# EAGLE design doppler_shield (EAGLE 7.2.0)
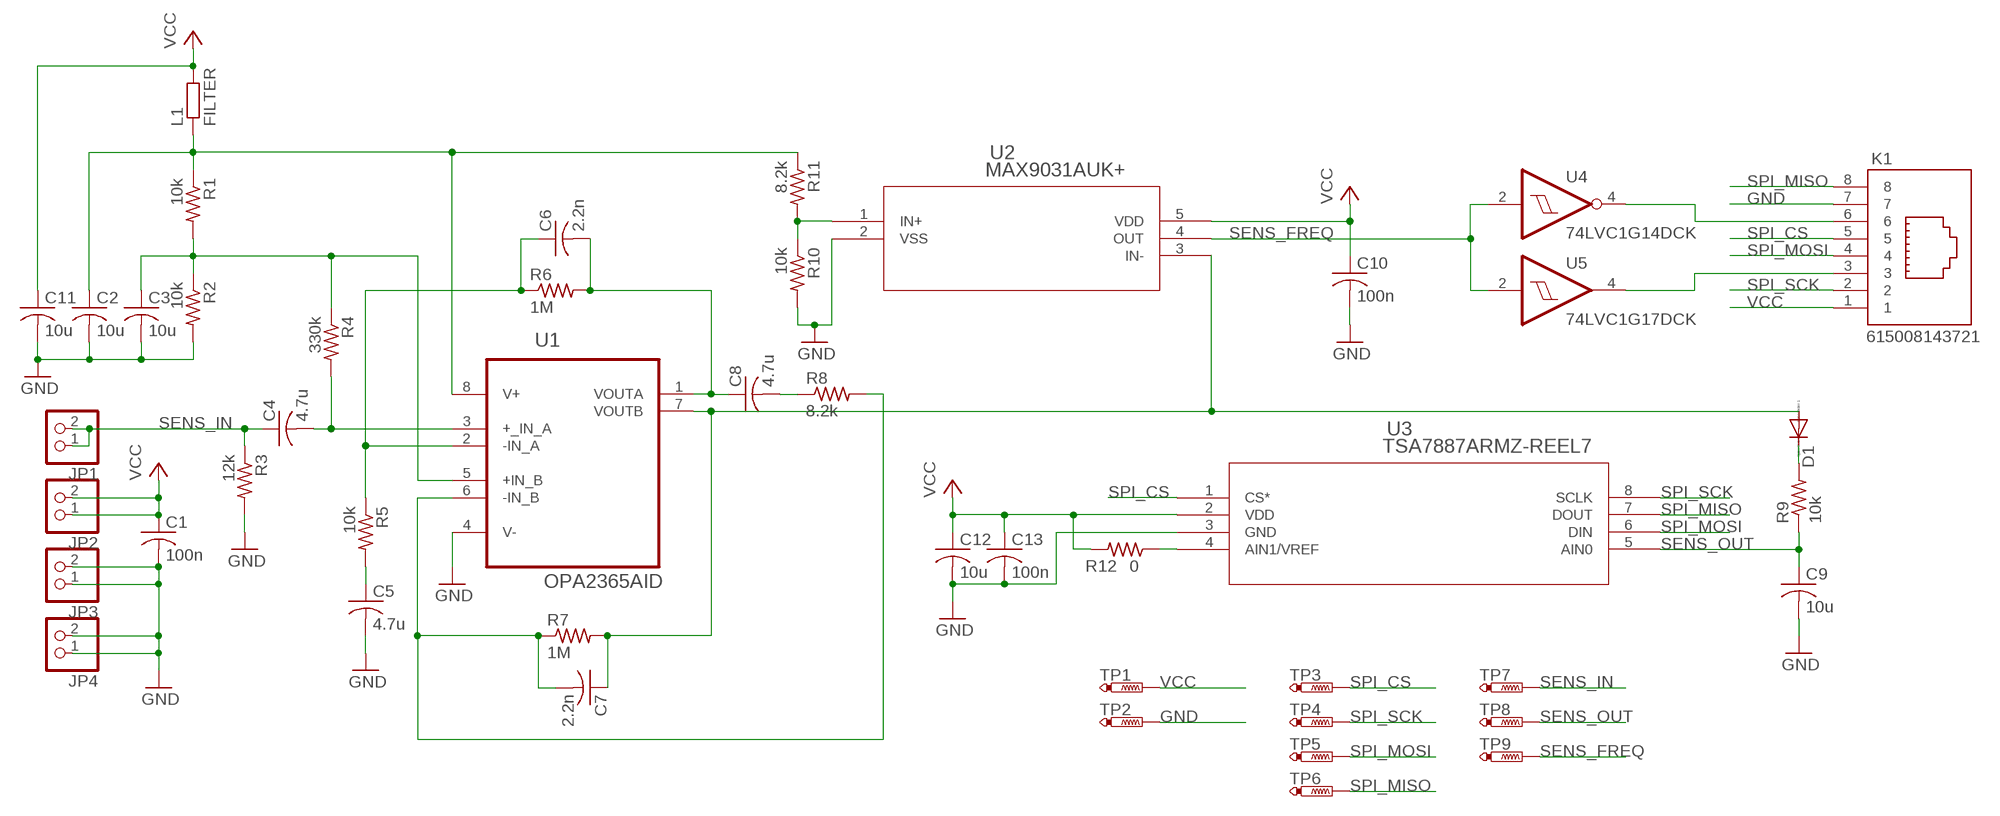
[diagram p0: schematic, sheet 1]

## Parts
C1  100n  C-USC0805  [C0805]
C2  10u  C-USC0805  [C0805]
C3  10u  C-USC0805  [C0805]
C4  4.7u  C-USC0805  [C0805]
C5  4.7u  C-USC0805  [C0805]
C6  2.2n  C-USC0805  [C0805]
C7  2.2n  C-USC0805  [C0805]
C8  4.7u  C-USC0805  [C0805]
C9  10u  C-USC0805  [C0805]
C10  100n  C-USC0805  [C0805]
C11  10u  C-USC0805  [C0805]
C12  10u  C-USC0805  [C0805]
C13  100n  C-USC0805  [C0805]
D1  DIODE-DO214AC  [DO214AC]
JP1  PINHD-1X2  [1X02]
JP2  PINHD-1X2  [1X02]
JP3  PINHD-1X2  [1X02]
JP4  PINHD-1X2  [1X02]
K1  615008143721  [615008143721]
L1  FILTER  R-EU_R0805  [R0805]
R1  10k  R-US_R0805  [R0805]
R2  10k  R-US_R0805  [R0805]
R3  12k  R-US_R0805  [R0805]
R4  330k  R-US_R0805  [R0805]
R5  10k  R-US_R0805  [R0805]
R6  1M  R-US_R0805  [R0805]
R7  1M  R-US_R0805  [R0805]
R8  8.2k  R-US_R0805  [R0805]
R9  10k  R-US_R0805  [R0805]
R10  10k  R-US_R0805  [R0805]
R11  8.2k  R-US_R0805  [R0805]
R12  0  R-US_R0805  [R0805]
TP1  PTR1B1,27  [B1,27]
TP2  PTR1B1,27  [B1,27]
TP3  PTR1B1,27  [B1,27]
TP4  PTR1B1,27  [B1,27]
TP5  PTR1B1,27  [B1,27]
TP6  PTR1B1,27  [B1,27]
TP7  PTR1B1,27  [B1,27]
TP8  PTR1B1,27  [B1,27]
TP9  PTR1B1,27  [B1,27]
U1  OPA2365AID  [SOIC127P600X175-8N]
U2  MAX9031AUK+  [21-0057F]
U3  TSA7887ARMZ-REEL7  AD7887ARMZ-REEL7  [RM_8]
U4  74LVC1G14DCK  [SC70-5]
U5  74LVC1G17DCK  [SC70-5]

## Nets
GND [ground]: C1.2 C2.2 C3.2 C5.2 C9.2 C10.2 C11.2 C12.2 C13.2 JP3.1 JP3.2 JP4.1 JP4.2 K1.7 R2.2 R3.2 R10.2 TP2.TP U1.4(V-) U2.2(VSS) U3.3(GND)
N$2: C3.1 R1.2 R2.1 R4.1 U1.5(+IN_B)
N$3: R10.1 R11.2 U2.1(IN+)
N$4: D1.C R9.2
N$5: R12.1 U3.4(AIN1/VREF)
N$6: K1.6 U4.4(O)
N$7: K1.3 U5.4(O)
N$11: C4.2 R4.2 U1.3(+_IN_A)
N$12: C5.1 R5.2
N$13: C6.1 R5.1 R6.1 U1.2(-IN_A)
N$14: C6.2 C8.1 R6.2 U1.1(VOUTA)
N$15: C8.2 R8.1
N$16: C7.2 R7.1 R8.2 U1.6(-IN_B)
N$19: C7.1 D1.A R7.2 U1.7(VOUTB) U2.3(IN-)
SENS_FREQ: TP9.TP U2.4(OUT) U4.2(I) U5.2(I)
SENS_IN: C4.1 JP1.1 JP1.2 R3.1 TP7.TP
SENS_OUT: C9.1 R9.1 TP8.TP U3.5(AIN0)
SPI_CS [SPI]: K1.5 TP3.TP U3.1(CS*)
SPI_MISO [SPI]: K1.8 TP6.TP U3.7(DOUT)
SPI_MOSI [SPI]: K1.4 TP5.TP U3.6(DIN)
SPI_SCK [SPI]: K1.2 TP4.TP U3.8(SCLK)
VCC [power]: C1.1 C10.1 C11.1 C12.1 C13.1 JP2.1 JP2.2 K1.1 L1.2 R12.2 TP1.TP U2.5(VDD) U3.2(VDD)
VCC_AMP: C2.1 L1.1 R1.1 R11.1 U1.8(V+)

## Power pins joined to a net without a drawn wire
GND: U4.3(GND) U5.3(GND)
VCC: U4.5(VCC) U5.5(VCC)

## Library data of the parts
C1-C13 = rcl:C-US: CAPACITOR, American symbol
D1 = diode:DIODE-: DIODE
JP1-JP4 = pinhead:PINHD-1X2: PIN HEADER
K1 = Input-Output_Connectors_rev15d:615008143721: WR-MJ Horizontal Plastic 8P8C Modular Jack Tab Down, 8 Pins=>Code : Con_I-O_MJ-H_Plastic_Down_615008143721 <http://katalog.we-online.de/media/images/eican/Con_I-O_MJ-H_Plastic_Down_615008143721_pf2.jpg> Details see: http://katalog.we-online.de/en/em/615_008_143_721 Created 2014-07-10, Karrer Zheng 2014 (C) Würth Elektronik
L1 = rcl:R-EU_: RESISTOR, European symbol
R1-R12 = resistor:R-US_: RESISTOR, American symbol
TP1-TP9 = testpad:PTR1: TEST PIN
U1 = Texas Instruments_By_element14_Batch_1:OPA2365AID: OPERATIONAL AMPLIFIER; MPN: OPA2365AID; OC_FARNELL: -; OC_NEWARK: 18M7498; PACKAGE: SOIC-8; SUPPLIER: Texas Instruments
U2 = maxim:MAX9031AUK+; MANUFACTURER_PART_NUMBER: max9031auk+; VENDOR: MAXIM
U3 = analog-devices:AD7887ARMZ-REEL7; COPYRIGHT: Copyright (C) 2015 Accelerated Designs. All rights reserved; DATAINTERFACE: DSP, MICROWIRE™, QSPI™, Serial, SPI™; DATASHEET: http://www.analog.com/static/imported-files/data_sheets/AD7887.pdf; DESCRIPTION: IC ADC 12BIT 2CHAN SRL 8MSOP; DIGIKEYPARTNUMBER: AD7887ARMZ-REEL7-ND; MANUFACTURER_PART_NUMBER: AD7887ARMZ-REEL7; MOUNTINGTYPE: Surface Mount; NUMBEROFBITS: 12; NUMBEROFCONVERTERS: 1; NUMBEROFINPUTSANDTYPE: 2 Single-Ended, Unipolar; OPERATINGTEMPERATURE: -40°C ~ 125°C; PACKAGING: Tape &amp Reel (TR); QUANTITY_AVAILABLE: 0; SUPPLIERDEVICEPACKAGE: 8-MSOP; VENDOR: Analog Devices Inc; VOLTAGESUPPLYSOURCE: Single Supply
U4 = 74xx-little-us:74*1G14: Single Schmitt-Trigger Inverter Gate
U5 = 74xx-little-us:74*1G17: Single Schmitt-Trigger Buffer

## Net classes
0 default: clearance 0.205 mm
1 power: clearance 0.205 mm to class 0, clearance 0.205 mm
2 ground: clearance 0.205 mm to class 0, clearance 0.205 mm to class 1, clearance 0.205 mm
3 SPI: clearance 0.205 mm to class 0, clearance 0.205 mm to class 1, clearance 0.205 mm to class 2, clearance 0.205 mm

## Board
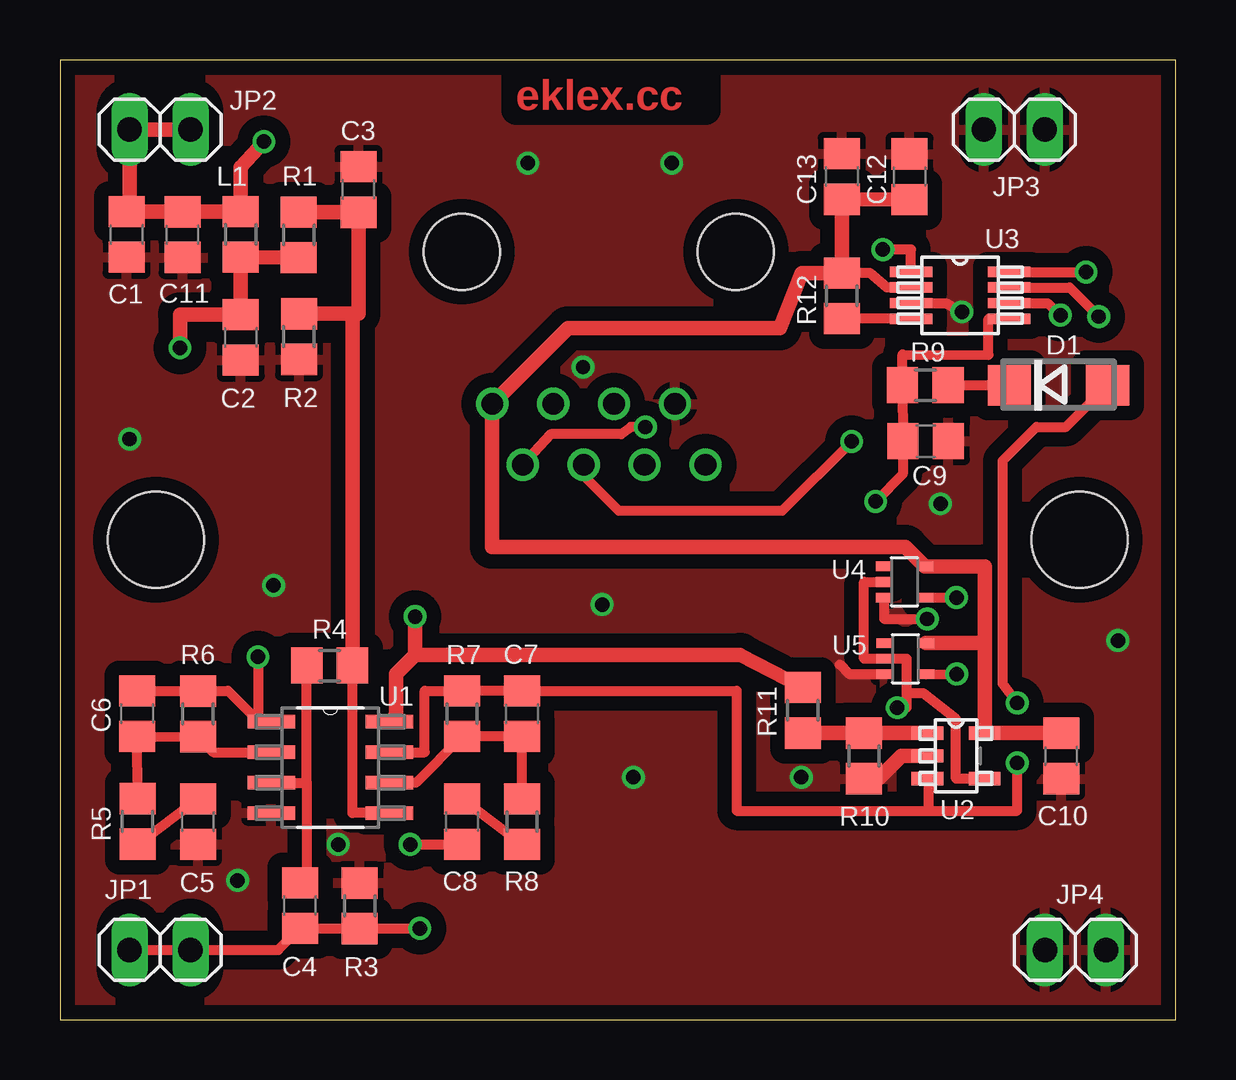
[diagram p1: board, top side]
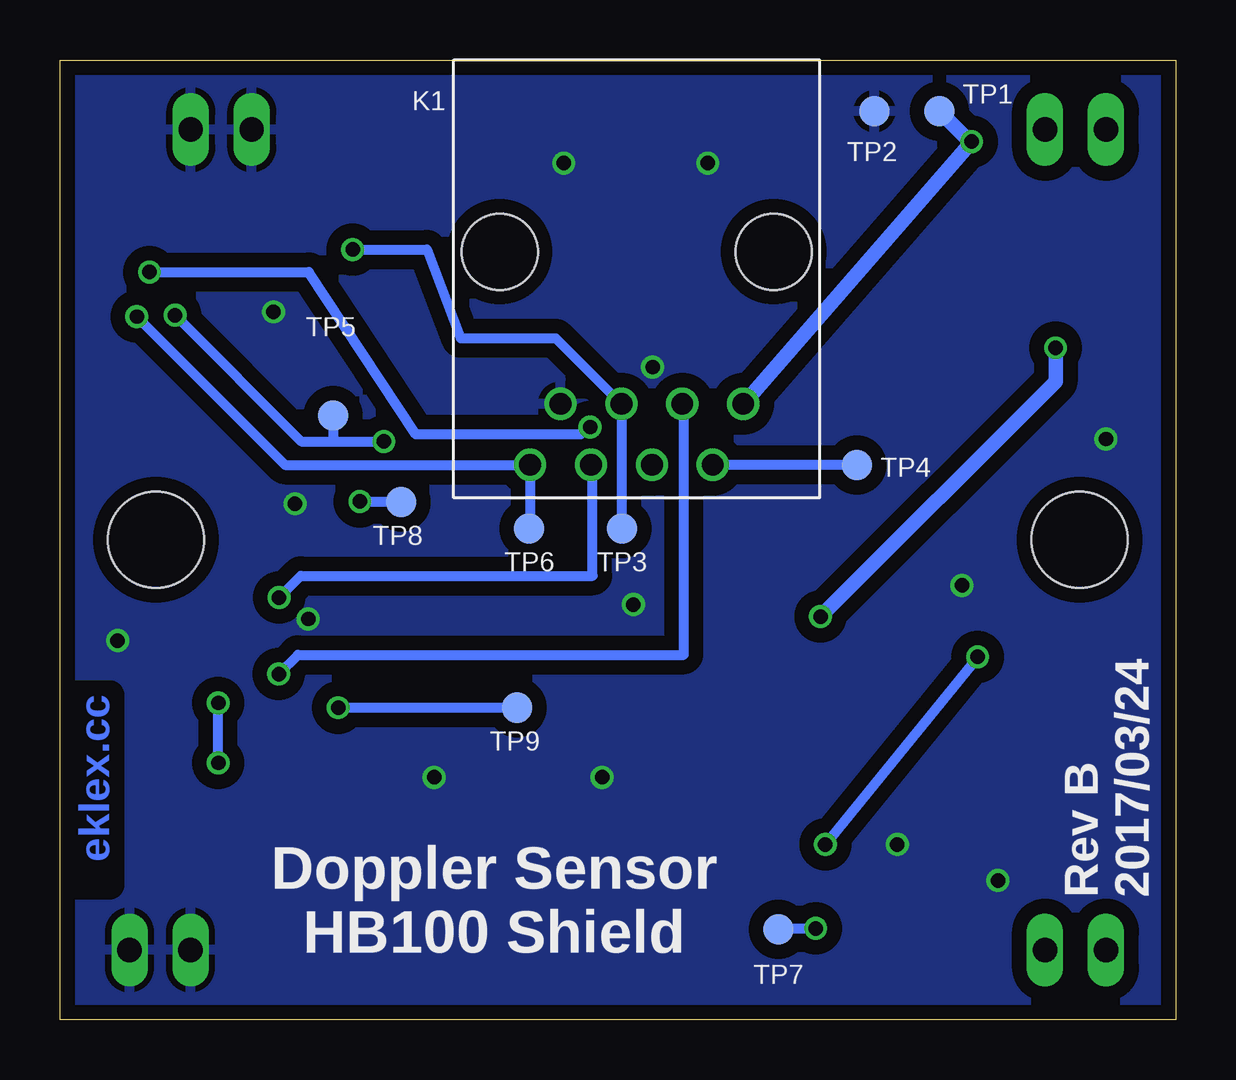
[diagram p2: board, bottom side, seen from below]

Size 46.5 x 40 mm. Coordinates in mm from the lower left corner, seen from the top.
Outline: 0,0 46.5,0 46.5,40 0,40 0,0
Copper layers (1*16): Top 0.0356mm / dielectric 1.5011mm / Bottom 0.0356mm
Design rules "oshpark-2layer": minimum track width 6mil, minimum drill 13mil, track to track 6mil, track to pad 6mil, pad to pad 6mil, via to via 6mil, smd to smd 6mil, copper to edge 15mil, drill to drill 6mil, minimum pad ring 7mil, minimum via ring 7mil, stop-mask expansion 2.5mil, vias tented up to drill 0mil, thermal gap 10mil
Holes 4 mm at 4,20 42.5,20

### Footprints (pad centres in the part's own frame; a part is rotated, then mirrored left to right if it is on the bottom)
C0805 = smd 1.3 x 1.5: 1 -0.95,0; 2 0.95,0
DO214AC = smd 1.8 x 1.7: A 2.05,0; C -2.05,0
1X02 = drill 1.016 long: 1 -1.27,0; 2 1.27,0
615008143721 = drill 0.9: 1 -4.445,6.35; 2 -3.175,8.89; 3 -1.905,6.35; 4 -0.635,8.89; 5 0.635,6.35; 6 1.905,8.89; 7 3.175,6.35; 8 4.445,8.89 | hole 3.17: -5.715,0; 5.715,0
R0805 = smd 1.3 x 1.5: 1 -0.95,0; 2 0.95,0
B1,27 = smd 1.27 x 1.27: TP 0,0
SOIC127P600X175-8N = smd 1.981 x 0.559: 1 -2.464,1.905; 2 -2.464,0.635; 3 -2.464,-0.635; 4 -2.464,-1.905; 5 2.464,-1.905; 6 2.464,-0.635; 7 2.464,0.635; 8 2.464,1.905
21-0057F = smd 1.321 x 0.559: 1 -1.194,0.95; 2 -1.194,0; 3 -1.194,-0.95; 4 1.194,-0.95; 5 1.194,0.95
RM_8 = smd 1.778 x 0.432: 1 -2.045,0.975; 2 -2.045,0.325; 3 -2.045,-0.325; 4 -2.045,-0.975; 5 2.045,-0.975; 6 2.045,-0.325; 7 2.045,0.325; 8 2.045,0.975
SC70-5 = smd 0.4 x 0.7: 1 -0.65,-0.85; 2 0,-0.85; 3 0.65,-0.85; 4 0.65,0.85; 5 -0.65,0.85

### Placement (x,y rotation side)
C1  2.78,32.73 270 top
C2  7.54,28.44 270 top
C3  12.44,34.6 90 top
C4  10,4.75 90 top
C5  5.75,8.25 270 top
C6  3.22,12.75 90 top
C7  19.26,12.75 270 top
C8  16.76,8.25 90 top
C9  36.08,24.11 0 top
C10  41.73,10.99 270 top
C11  5.11,32.72 270 top
C12  35.41,35.13 90 top
C13  32.59,35.14 90 top
D1  41.62,26.44 0 top
JP1  4.17,2.9 0 top
JP2  4.17,37.1 0 top
JP3  39.78,37.1 0 top
JP4  42.33,2.9 0 top
K1  22.46,32.01 180 bottom
L1  7.54,32.73 90 top
R1  9.95,32.71 90 top
R2  9.96,28.47 270 top
R3  12.49,4.74 90 top
R4  11.24,14.76 180 top
R5  3.23,8.26 270 top
R6  5.75,12.74 90 top
R7  16.76,12.75 90 top
R8  19.26,8.25 90 top
R9  36.07,26.44 0 top
R10  33.51,10.99 270 top
R11  30.96,12.89 270 top
R12  32.59,30.17 90 top
TP1  9.84,37.87 0 bottom
TP2  12.56,37.87 0 bottom
TP3  23.08,20.47 0 bottom
TP4  13.28,23.11 0 bottom
TP5  35.12,25.17 0 bottom
TP6  26.94,20.47 0 bottom
TP7  16.56,3.77 0 bottom
TP8  32.28,21.57 0 bottom
TP9  27.45,13 0 bottom
U1  11.27,10.51 0 top
U2  37.35,10.99 0 top
U3  37.52,30.19 0 top
U4  35.2,18.24 270 top
U5  35.24,15.04 270 top

### Tracks (layer width: path | path; a pad name or v marks a point on that pad's centre or on a via)
GND  (via drill 0.6)
  Top 0.406: U4.3 34.35,16.7 v36.15,16.7 | U3.3 36.95,29.86 v37.6,29.5 | U5.3 32.91,14.39 32.5,14.8
  Top 0.61: U2.2 35.07,10.99 34.13,10.05 R10.2
  other vias: 8.9,18.1 30.9,10.1 21.8,27.2 19.5,35.7 25.5,35.7 23.9,10.1 2.9,24.2 36.7,21.5 7.4,5.8 11.6,7.3 22.6,17.3 44.1,15.8
  pour Bottom (isolate 0.61): -5,49.3 -5,53.4 49.2,53.4 49.2,-5.8 -3.5,-5.8 -3.5,49.4 -4.9,49.4
  pour Top (isolate 0.61): -9.5,51 -9.5,55.1 51.8,55.1 51.8,-4.4 -8.4,-4.4 -8.4,51
N$2
  Top 0.406: U1.5 12.19,8.61 R4.1
  Top 0.61: R1.2 C3.1 12.44,29.42 12.19,29.42 | R2.1 12.19,29.42 | 12.19,29.42 R4.1
N$3
  Top 0.61: R11.2 R10.1 U2.1
N$4
  Top 0.406: R9.2 D1.C
N$5
  Top 0.406: U3.4 R12.1
N$6  (via drill 0.6)
  Top 0.406: U4.4 v37.37,17.59
  Bottom 0.406: v37.37,17.59 36.46,18.5 24.3,18.5 24.3,23.12 K1.6
N$7  (via drill 0.6)
  Top 0.406: U5.4 v37.38,14.4
  Bottom 0.406: v37.38,14.4 36.58,15.2 20.5,15.2 20.5,25.66 K1.3
N$11
  Top 0.406: U1.3 10.29,9.88 | 10.29,9.88 R4.2 | 10.29,9.88 10.29,5.99 C4.2
N$12
  Top 0.406: R5.2 C5.1
N$13
  Top 0.406: R5.1 C6.1 R6.1 6.39,11.14 U1.2
N$14  (via drill 0.6)
  Top 0.406: C6.2 R6.2 7,13.7 8.25,12.45 | 8.25,12.45 8.29,12.41 U1.1 | v14.6,7.3 C8.1 | v8.25,15.12 8.25,12.45
  Bottom 0.406: v8.25,15.12 v14.6,7.3
N$15
  Top 0.406: R8.1 C8.2
N$16
  Top 0.406: R8.2 C7.2 R7.1 14.84,9.88 U1.6
N$19  (via drill 0.6)
  Top 0.406: U1.7 15.2,11.14 15.2,13.7 R7.2 C7.1 28.2,13.7 28.2,8.7 36.2,8.7 | U2.3 36.2,10.04 36.2,8.7 | 36.2,8.7 39.9,8.7 v39.9,10.7 | D1.A 41.93,24.7 40.7,24.7 39.3,23.3 39.3,14 v39.9,13.2
  Bottom 0.406: v39.9,10.7 v39.9,13.2
SENS_FREQ  (via drill 0.6)
  Top 0.406: U4.2 33.52,18.24 33.52,15.04 U5.2 35.3,15.04 35.3,13.6 | U2.4 37.35,10.04 37.35,12.53 35.98,13.6 35.3,13.6 | v34.9,13 35.3,13 35.3,13.6
  Bottom 0.406: TP9.TP v34.9,13
SENS_IN  (via drill 0.6)
  Top 0.406: JP1.1 JP1.2 9.1,2.9 C4.1 R3.1 v14.99,3.79 v15,3.8
  Bottom 0.406: TP7.TP 16.53,3.8 v15,3.8
SENS_OUT  (via drill 0.6)
  Top 0.406: U3.5 38.7,29.21 38.7,27.7 35.12,27.72 R9.1 C9.1 35.13,22.73 v34,21.6
  Bottom 0.406: TP8.TP 33.97,21.57 v34,21.6
SPI_CS  (via drill 0.6)
  Top 0.406: U3.1 35.48,32.1 v34.3,32.1
  Bottom 0.406: v34.3,32.1 31.2,32.1 29.8,28.4 25.84,28.4 K1.5 23.08,25.64 TP3.TP
SPI_MISO  (via drill 0.6)
  Top 0.406: U3.7 42.09,30.52 v43.3,29.3
  Bottom 0.406: v43.3,29.3 37.12,23.12 K1.8 26.91,20.47 TP6.TP
SPI_MOSI  (via drill 0.6)
  Top 0.406: U3.6 41.17,29.86 v41.7,29.36 | v33,24.1 30.1,21.2 23.3,21.2 21.82,22.68 K1.4
  Bottom 0.406: v41.7,29.36 36.44,24.1 35.12,24.1 | 35.12,24.1 v33,24.1 | TP5.TP 35.12,24.1
SPI_SCK  (via drill 0.6)
  Top 0.406: U3.8 v42.77,31.16 | v24.4,24.7 23.8,24.7 23.4,24.4 20.46,24.4 K1.2
  Bottom 0.406: v42.77,31.16 36.13,31.16 31.67,24.4 24.8,24.4 v24.4,24.7 | TP4.TP 13.78,23.12 K1.2
VCC  (via drill 0.6)
  Top 0.406: U3.2 34.47,30.52 33.76,31.12 R12.2
  Top 0.61: JP2.2 JP2.1 2.9,33.68 C1.1 C11.1 L1.2 7.54,35.54 v8.5,36.6 | C10.1 U2.5 38.54,15.69 | 38.54,15.69 U5.5 | 38.54,15.69 38.54,18.89 U4.5 35.24,19.7 18,19.7 18.02,19.71 K1.1 21.18,28.82 30,28.82 30.9,31.1 30.92,31.12 R12.2 C13.1 C12.1
  Bottom 0.61: TP1.TP 8.57,36.6 v8.5,36.6 K1.1
VCC_AMP  (via drill 0.6)
  Top 0.61: R1.1 L1.1 C2.1 5,29.39 v5,28 | v14.8,16.8 14.8,15.2 | 14.8,15.2 14,14.4 14,12.68 U1.8 | 14.8,15.2 28.35,15.2 R11.1
  Bottom 0.61: v5,28 5,26.6 v14.8,16.8

### Text on the board
Top: eklex.cc
Bottom: eklex.cc
bPlace: Rev B / 2017/03/24 | Doppler Sensor / HB100 Shield